# Altium schematic sheet ADuCDn.SchDoc
size A4; SheetNumber: 1; SheetTotal: 1
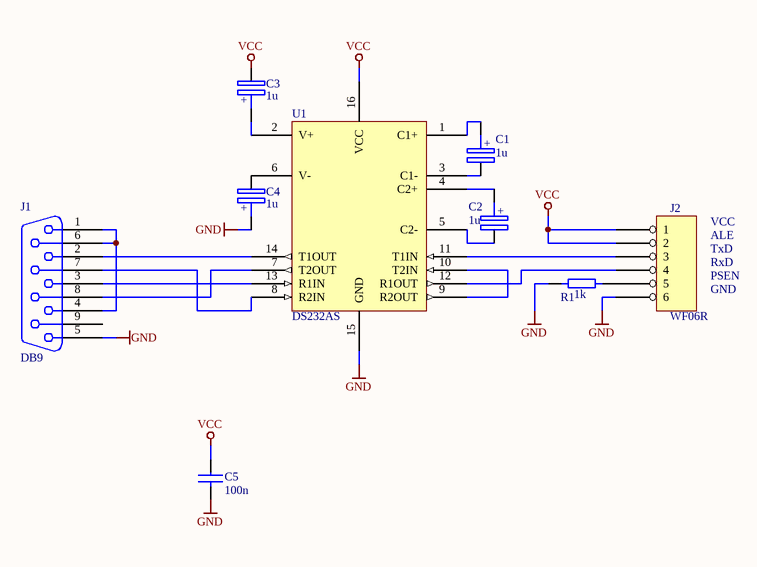
[diagram p0: ADuCDn.SchDoc]

## Parts
C1  1u  [CEL1210]
C2  1u  [CEL1210]
C3  1u  [CEL1210]
C4  1u  [CEL1210]
C5  100n  [1206]
J1  DB9  [DB9SL]
J2  WF06R  [WF06R]
R1  1k  [1206]
U1  DS232AS  [16SOIC150]

## Nets
GND: C4.2 C5.2 J1.5 J2.6 R1.1 U1.15(GND)
VCC: C3.1 C5.1 J2.1 J2.2 U1.16(VCC)
NetC1_1: C1.1 U1.3(C1-)
NetC1_2: C1.2 U1.1(C1+)
NetC2_1: C2.1 U1.5(C2-)
NetC2_2: C2.2 U1.4(C2+)
NetC3_2: C3.2 U1.2(V+)
NetC4_1: C4.1 U1.6(V-)
NetJ1_1: J1.1 J1.4 J1.6
NetJ1_2: J1.2 U1.14(T1OUT)
NetJ1_3: J1.3 U1.13(R1IN)
NetJ1_7: J1.7 U1.8(R2IN)
NetJ1_8: J1.8 U1.7(T2OUT)
NetJ2_3: J2.3 U1.11(T1IN)
NetJ2_4: J2.4 U1.12(R1OUT)
NetJ2_5: J2.5 R1.2
NetU1_9: U1.9(R2OUT) U1.10(T2IN)

Not connected (* = marked no-connect by the designer): J1 9

## Notes on the sheet
- VCC
- ALE
- TxD
- RxD
- PSEN
- GND
- (in symbol CEL1210) +

## Library data of the parts
C1-C4 = CEL1210
C5 = C1206
J1 = CONNECTOR DB9
J2 = HEADER 6
R1 = R
U1 = MAX232 1